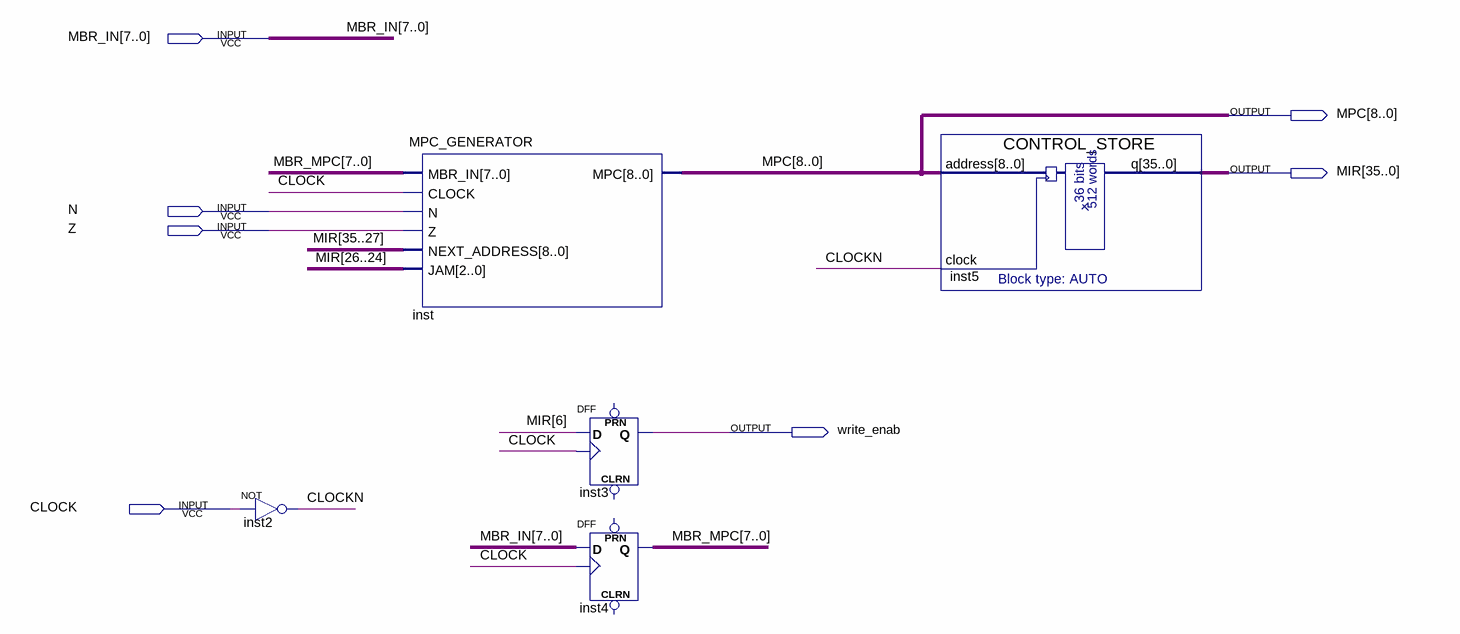
[diagram p0: schematic sheet]
// Quartus schematic CONTROL_UNIT.bdf as structural Verilog: 5 symbols, 7 pins
module CONTROL_UNIT (
  input  [7:0] MBR_IN,
  input  N,
  input  Z,
  input  CLOCK,
  output [8:0] MPC,
  output [35:0] MIR,
  output write_enab
);

  wire CLOCKN;
  wire [7:0] MBR_MPC;

  not inst2 (CLOCKN, CLOCK);
  MPC_GENERATOR inst (
    .MBR_IN(MBR_MPC), .CLOCK(CLOCK), .N(N), .Z(Z), .NEXT_ADDRESS(MIR[35:27]), .JAM(MIR[26:24]), .MPC(MPC));
  DFF inst3 (.CLK(CLOCK), .D(MIR[6]), .Q(write_enab));  // open: CLRN, PRN
  DFF inst4[7:0] (.CLK(CLOCK), .D(MBR_IN), .Q(MBR_MPC));  // open: CLRN, PRN
  CONTROL_STORE inst5 (.address(MPC), .clock(CLOCKN), .q(MIR));
endmodule
